# EasyEDA Pro project usb_conn_breakout.eprj

# Schematic usb_conn_sch
Board Name: PCB2; Create Date: 2025-12-19; Page Name: P1; Project Name: usb_conn_breakout; Schematic Name: Schematic1; Update Date: 2025-12-19; Company: EasyEDA.com; Page Size: A4; Version: V1.0
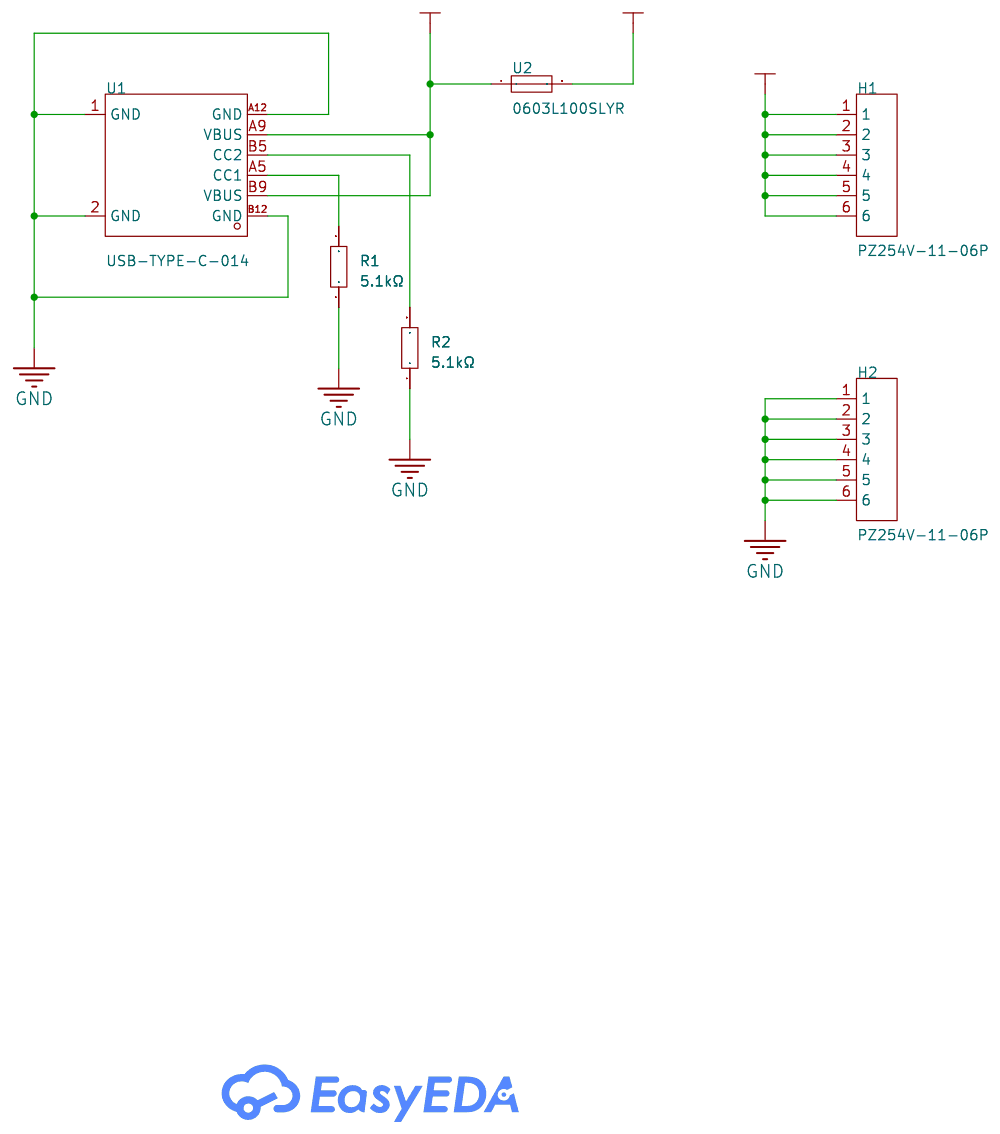
[diagram p0: schematic sheet]

## Parts
H1  PZ254V-11-06P  [HDR-TH_6P-P2.54-V-M]
H2  PZ254V-11-06P  [HDR-TH_6P-P2.54-V-M]
R1  5.1kΩ  [R0805]
R2  5.1kΩ  [R0805]
U1  USB-TYPE-C-014  [USB-C-TH_USB-TYPE-C-014]
U2  0603L100SLYR  [R0603]

## Library data of the parts
H1 H2 = PZ254V-11-06P: LCSC Part Name: 1x6P 间距:2.54mm 方针 直插; Supplier Part: C492405; Manufacturer: XFCN(兴飞); Supplier Footprint: 插件,P=2.54mm; JLCPCB Part Class: Extended Part; Datasheet: https://item.szlcsc.com/datasheet/PZ254V-11-06P/502961.html; Supplier: LCSC; Pin Structure: 1x6P; Pitch: 2.54mm; Circluar Pins/Square Pins: Pin Header; Mounting Type: Through Hole; Number of Rows: 1; Number of Pins: 6P; Length of Mating Pin: 6mm; Insulation Height: 2.5mm; Length of End Connection Pin: 3mm; Contact Material: Brass; Operating Temperature: -40℃~+105℃; Color: Black
R1 R2 = 0805W8F1002T5E: LCSC Part Name: 10kΩ ±1% 125mW 厚膜电阻; Supplier Part: C17414; Manufacturer: UNI-ROYAL(厚声); Supplier Footprint: 0805; JLCPCB Part Class: Basic Part; Datasheet: https://item.szlcsc.com/datasheet/0805W8F1002T5E/18102.html; Supplier: LCSC; Type: Thick Film Resistor; Tolerance: ±1%; Power(Watts): 125mW; Voltage-Supply(Max): 150V; Temperature Coefficient: ±100ppm/℃; Operating Temperature: -55℃~+155℃
U1 = USB-TYPE-C-014: LCSC Part Name: Type-C 母 直插; Supplier Part: C2927034; Manufacturer: DEALON(德艺隆); Supplier Footprint: 插件; JLCPCB Part Class: Extended Part; Datasheet: https://item.szlcsc.com/datasheet/USB-TYPE-C-014/3252503.html; Supplier: LCSC; Connector Type: Type-C; Gender: Female; Mounting Type: Through Hole; Number of Contacts: 6P; Number of Ports: 1; Current Rating-Power: 3A; Voltage Rating: 5V; Connect-Disconnect Life: 5000 cycles; Length: 6.8mm; Operating Temperature: -25℃~+85℃
U2 = 0603L100SLYR: LCSC Part Name: 6V 1A 0603自恢复; Supplier Part: C207017; Manufacturer: Littelfuse(美国力特); Supplier Footprint: 0603; JLCPCB Part Class: Extended Part; Datasheet: https://item.szlcsc.com/datasheet/0603L100SLYR/208136.html; Supplier: LCSC; Voltage - Max: 6V; Current - Max: 50A; Hold Current: 1A; Trip Current: 1.8A; Power Dissipation: 600mW; Resistance - Initial (Ri) (Min): 40mΩ; Resistance - Post Trip (R1) (Max): 120mΩ; Time to Trip(Max): 300ms; Operating Temperature: -40℃~+85℃

## Nets
+5V_USB: H1.1 H1.2 H1.3 H1.4 H1.5 H1.6 U2.2
+5V_USB_UF: U1.A9(VBUS) U1.B9(VBUS) U2.1
GND: H2.1 H2.2 H2.3 H2.4 H2.5 H2.6 R1.1 R2.1 U1.1(GND) U1.2(GND) U1.A12(GND) U1.B12(GND)
Net-(R1-2): R1.2 U1.A5(CC1)
Net-(R2-2): R2.2 U1.B5(CC2)

# Board usb_conn_pcb
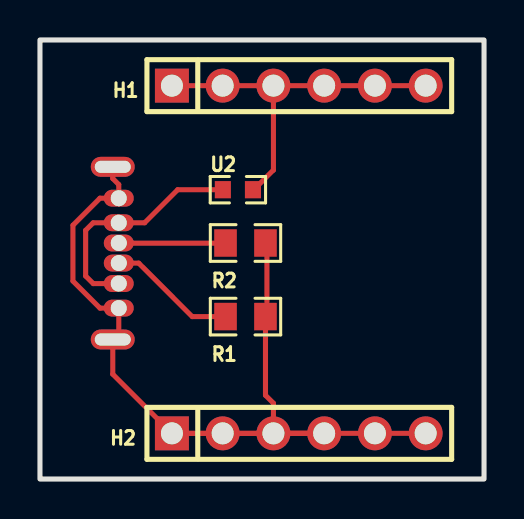
[diagram p1: board, top side]
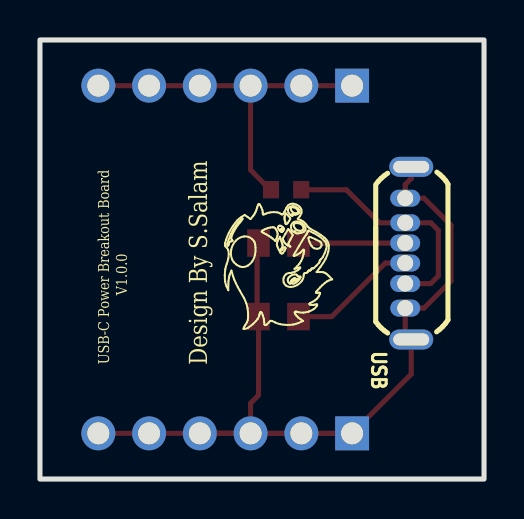
[diagram p2: board, bottom side, seen from below]

Outline 22.22 x 21.97 mm; copper layers: Top Layer, Bottom Layer. Coordinates in mm from the lower left corner of the outline.
Outline path: rectangle 0,21.97 22.22,0
Stack: Top Layer 0.035mm / Dielectric1 1.51mm FR4 er 4.5 / Bottom Layer 0.035mm

## Design rules (mm)
template: JLCPCB Capability(Two Layers Board)
spacing copperThickness1oz (default): track to track 0.102, other pairs 0.152 to 0.3
spacing copperThickness2oz: track to track 0.203, other pairs 0.152 to 0.3
track width copperThickness1oz (default): min 0.127, default 0.254, max 2.54
track width copperThickness2oz: min 0.203, default 0.254, max 2.54
differential pair differentialPair (default): width min 0.127, default 0.254, max 2.54; gap min 0.152, default 0.152
via viaSize (default): diameter min 0.5, default 0.61, max 10; hole min 0.3, default 0.305, max 6.3

## Placement (name value [footprint] x y rotation side)
H1  PZ254V-11-06P  [HDR-TH_6P-P2.54-V-M]  12.95 19.69 0 top
H2  PZ254V-11-06P  [HDR-TH_6P-P2.54-V-M]  12.95 2.29 0 top
R1  5.1kΩ  [R0805]  10.29 8.13 180 top
R2  5.1kΩ  [R0805]  10.29 11.81 180 top
U2  0603L100SLYR  [R0603]  9.91 14.48 0 top
USB  USB-TYPE-C-014  [USB-C-TH_USB-TYPE-C-014]  3.79 11.3 90 bottom

## Footprints (pads in the part's own frame, mm; a bottom-side part is the same pattern mirrored in y, then rotated)
HDR-TH_6P-P2.54-V-M
  rect 1.7x1.7 hole 1.1: 1(-6.35,0)
  round 1.7 hole 1.1: 2(-3.81,0) 3(-1.27,0) 4(1.27,0) 5(3.81,0) 6(6.35,0)
R0603
  rect 0.806x0.864 smd: 1(-0.753,0) 2(0.753,0)
R0805
  rect 1.133x1.377 smd: 1(-1,0) 2(1,0)
USB-C-TH_USB-TYPE-C-014
  oval 1x2.2 hole 0.6x1.8: 1(-4.32,-0.15) 2(4.32,-0.15)
  oval 0.85x1.5 hole 0.8: A5(-0.495,0.152) A9(1.52,0.15) A12(2.75,0.15) B5(0.508,0.152) B9(-1.52,0.15) B12(-2.75,0.15)

## Nets
+5V_USB: H1.1 H1.2 H1.3 H1.4 H1.5 H1.6 U2.2
+5V_USB_UF: U2.1 USB.A9 USB.B9
GND: H2.1 H2.2 H2.3 H2.4 H2.5 H2.6 R1.1 R2.1 USB.1 USB.2 USB.A12 USB.B12
$1N680: R1.2 USB.A5
$1N686: R2.2 USB.B5

## Routing (per net, layer and track width the routed paths; a pad name or vN(x,y) marks a point on that pad's centre or on a via; arc(x,y) is an arc through that point)
+5V_USB: length 18.3
  Top Layer w0.254: H1.3 H1.1 ; H1.3 11.68,15.46 10.7,14.48 ; H1.3 H1.6
+5V_USB_UF: length 11.8
  Top Layer w0.254: USB.B9 3.94,9.78 2.67,9.78 2.29,10.16 2.29,12.45 2.66,12.82 USB.A9 5.24,12.82 6.89,14.48 U2.1
GND: length 50.4
  Top Layer w0.254: USB.2 3.64,15.04 3.94,14.74 USB.A12 3,14.05 1.65,12.7 1.65,9.91 3,8.55 USB.B12 3.94,7.28 USB.1 3.64,5.25 H2.1 ; H2.1 H2.4 ; H2.1 H2.4 ; H2.4 H2.3 11.68,3.79 11.29,4.19 R1.1 ; H2.4 H2.6 ; 11.36,11.81 11.36,8.13
$1N680: length 6.4
  Top Layer w0.254: 3.94,10.8 4.94,10.8 7.62,8.13 9.21,8.13
$1N686: length 5.3
  Top Layer w0.254: 3.94,11.8 9.21,11.8

## Text on the board
Bottom Silkscreen Layer: USB-C Power Breakout Board / V1.0.0 | Design By S.Salam
